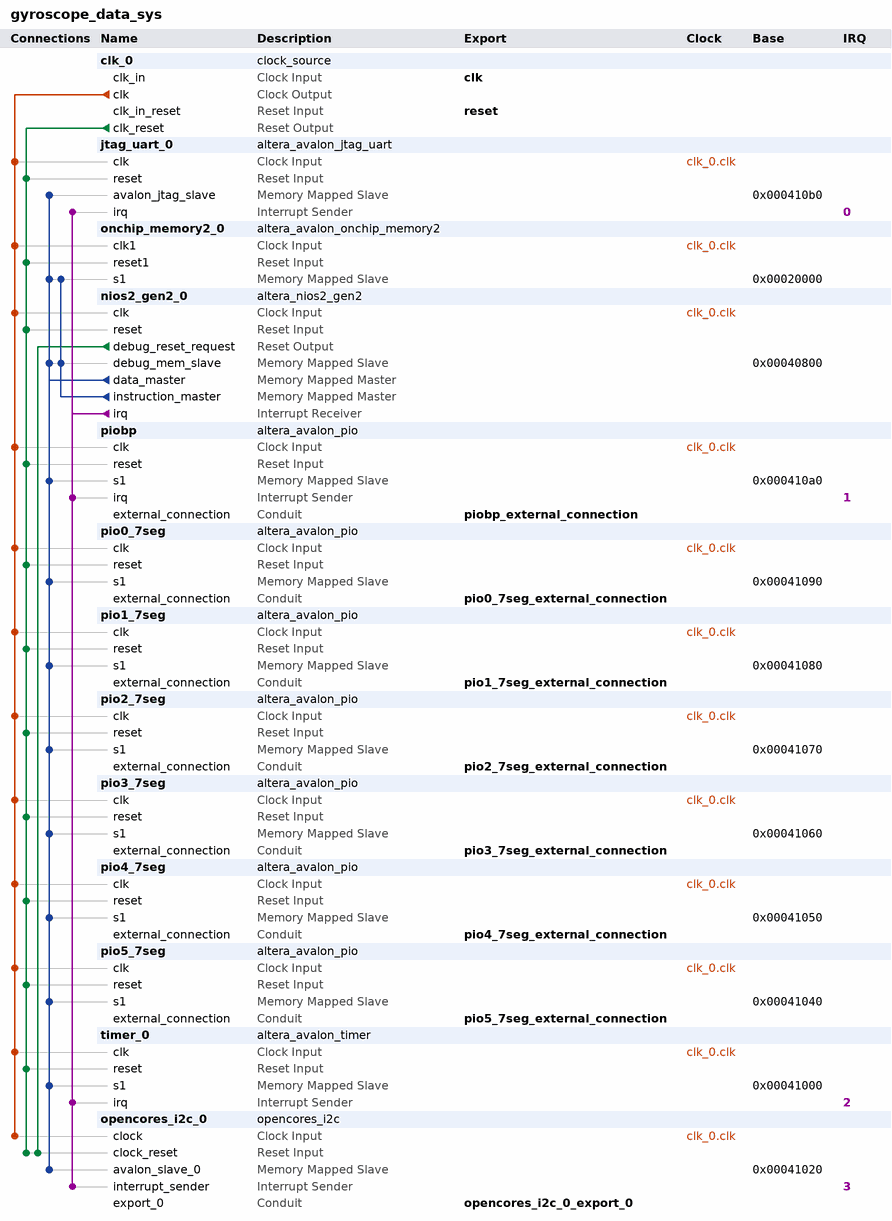
[diagram p0: system contents]
# Platform Designer (Qsys) system gyroscope_data_sys, Cyclone V 5CGXFC7C7F23C8
# Parameters at their usual value, and those the tool derives, are not listed.
package require -exact qsys 18.1
create_system gyroscope_data_sys
set_project_property DEVICE_FAMILY {Cyclone V}
set_project_property DEVICE 5CGXFC7C7F23C8

add_instance clk_0 clock_source 18.1
set_instance_parameter_value clk_0 clockFrequency 50000000

add_instance jtag_uart_0 altera_avalon_jtag_uart 18.1
set_instance_parameter_value jtag_uart_0 simInteractiveOptions NO_INTERACTIVE_WINDOWS

add_instance onchip_memory2_0 altera_avalon_onchip_memory2 18.1
set_instance_parameter_value onchip_memory2_0 dataWidth 32
set_instance_parameter_value onchip_memory2_0 dualPort false
set_instance_parameter_value onchip_memory2_0 initMemContent false
set_instance_parameter_value onchip_memory2_0 initializationFileName C:/intelFPGA/18.1/Podgorski_Lab3/Software/App/mem_init/gyroscope_data_sys_onchip_memory2_0.hex
set_instance_parameter_value onchip_memory2_0 memorySize 80000

add_instance nios2_gen2_0 altera_nios2_gen2 18.1
set_instance_parameter_value nios2_gen2_0 dcache_size 2048
set_instance_parameter_value nios2_gen2_0 exceptionSlave onchip_memory2_0.s1
set_instance_parameter_value nios2_gen2_0 icache_size 4096
set_instance_parameter_value nios2_gen2_0 impl Tiny
set_instance_parameter_value nios2_gen2_0 resetSlave onchip_memory2_0.s1

add_instance piobp altera_avalon_pio 18.1
set_instance_parameter_value piobp captureEdge true
set_instance_parameter_value piobp direction Input
set_instance_parameter_value piobp edgeType FALLING
set_instance_parameter_value piobp generateIRQ true
set_instance_parameter_value piobp irqType EDGE
set_instance_parameter_value piobp width 1

add_instance pio0_7seg altera_avalon_pio 18.1
set_instance_parameter_value pio0_7seg direction Output
set_instance_parameter_value pio0_7seg width 4

add_instance pio1_7seg altera_avalon_pio 18.1
set_instance_parameter_value pio1_7seg direction Output
set_instance_parameter_value pio1_7seg width 4

add_instance pio2_7seg altera_avalon_pio 18.1
set_instance_parameter_value pio2_7seg direction Output
set_instance_parameter_value pio2_7seg width 4

add_instance pio3_7seg altera_avalon_pio 18.1
set_instance_parameter_value pio3_7seg direction Output
set_instance_parameter_value pio3_7seg width 4

add_instance pio4_7seg altera_avalon_pio 18.1
set_instance_parameter_value pio4_7seg direction Output
set_instance_parameter_value pio4_7seg width 4

add_instance pio5_7seg altera_avalon_pio 18.1
set_instance_parameter_value pio5_7seg direction Output
set_instance_parameter_value pio5_7seg width 4

add_instance timer_0 altera_avalon_timer 18.1
set_instance_parameter_value timer_0 period 1
set_instance_parameter_value timer_0 periodUnits SEC

add_instance opencores_i2c_0 opencores_i2c 9.1

# connections
add_connection clk_0.clk jtag_uart_0.clk clock
add_connection clk_0.clk nios2_gen2_0.clk clock
add_connection clk_0.clk onchip_memory2_0.clk1 clock
add_connection clk_0.clk opencores_i2c_0.clock clock
add_connection clk_0.clk pio0_7seg.clk clock
add_connection clk_0.clk pio1_7seg.clk clock
add_connection clk_0.clk pio2_7seg.clk clock
add_connection clk_0.clk pio3_7seg.clk clock
add_connection clk_0.clk pio4_7seg.clk clock
add_connection clk_0.clk pio5_7seg.clk clock
add_connection clk_0.clk piobp.clk clock
add_connection clk_0.clk timer_0.clk clock
add_connection clk_0.clk_reset jtag_uart_0.reset reset
add_connection clk_0.clk_reset nios2_gen2_0.reset reset
add_connection clk_0.clk_reset onchip_memory2_0.reset1 reset
add_connection clk_0.clk_reset opencores_i2c_0.clock_reset reset
add_connection clk_0.clk_reset pio0_7seg.reset reset
add_connection clk_0.clk_reset pio1_7seg.reset reset
add_connection clk_0.clk_reset pio2_7seg.reset reset
add_connection clk_0.clk_reset pio3_7seg.reset reset
add_connection clk_0.clk_reset pio4_7seg.reset reset
add_connection clk_0.clk_reset pio5_7seg.reset reset
add_connection clk_0.clk_reset piobp.reset reset
add_connection clk_0.clk_reset timer_0.reset reset
add_connection nios2_gen2_0.debug_reset_request opencores_i2c_0.clock_reset reset
add_connection nios2_gen2_0.data_master jtag_uart_0.avalon_jtag_slave avalon
set_connection_parameter_value nios2_gen2_0.data_master/jtag_uart_0.avalon_jtag_slave baseAddress 0x000410b0
add_connection nios2_gen2_0.data_master nios2_gen2_0.debug_mem_slave avalon
set_connection_parameter_value nios2_gen2_0.data_master/nios2_gen2_0.debug_mem_slave baseAddress 0x00040800
add_connection nios2_gen2_0.data_master onchip_memory2_0.s1 avalon
set_connection_parameter_value nios2_gen2_0.data_master/onchip_memory2_0.s1 baseAddress 0x00020000
add_connection nios2_gen2_0.data_master opencores_i2c_0.avalon_slave_0 avalon
set_connection_parameter_value nios2_gen2_0.data_master/opencores_i2c_0.avalon_slave_0 baseAddress 0x00041020
add_connection nios2_gen2_0.data_master pio0_7seg.s1 avalon
set_connection_parameter_value nios2_gen2_0.data_master/pio0_7seg.s1 baseAddress 0x00041090
add_connection nios2_gen2_0.data_master pio1_7seg.s1 avalon
set_connection_parameter_value nios2_gen2_0.data_master/pio1_7seg.s1 baseAddress 0x00041080
add_connection nios2_gen2_0.data_master pio2_7seg.s1 avalon
set_connection_parameter_value nios2_gen2_0.data_master/pio2_7seg.s1 baseAddress 0x00041070
add_connection nios2_gen2_0.data_master pio3_7seg.s1 avalon
set_connection_parameter_value nios2_gen2_0.data_master/pio3_7seg.s1 baseAddress 0x00041060
add_connection nios2_gen2_0.data_master pio4_7seg.s1 avalon
set_connection_parameter_value nios2_gen2_0.data_master/pio4_7seg.s1 baseAddress 0x00041050
add_connection nios2_gen2_0.data_master pio5_7seg.s1 avalon
set_connection_parameter_value nios2_gen2_0.data_master/pio5_7seg.s1 baseAddress 0x00041040
add_connection nios2_gen2_0.data_master piobp.s1 avalon
set_connection_parameter_value nios2_gen2_0.data_master/piobp.s1 baseAddress 0x000410a0
add_connection nios2_gen2_0.data_master timer_0.s1 avalon
set_connection_parameter_value nios2_gen2_0.data_master/timer_0.s1 baseAddress 0x00041000
add_connection nios2_gen2_0.instruction_master nios2_gen2_0.debug_mem_slave avalon
set_connection_parameter_value nios2_gen2_0.instruction_master/nios2_gen2_0.debug_mem_slave baseAddress 0x00040800
add_connection nios2_gen2_0.instruction_master onchip_memory2_0.s1 avalon
set_connection_parameter_value nios2_gen2_0.instruction_master/onchip_memory2_0.s1 baseAddress 0x00020000
add_connection nios2_gen2_0.irq jtag_uart_0.irq interrupt
set_connection_parameter_value nios2_gen2_0.irq/jtag_uart_0.irq irqNumber 0
add_connection nios2_gen2_0.irq opencores_i2c_0.interrupt_sender interrupt
set_connection_parameter_value nios2_gen2_0.irq/opencores_i2c_0.interrupt_sender irqNumber 3
add_connection nios2_gen2_0.irq piobp.irq interrupt
set_connection_parameter_value nios2_gen2_0.irq/piobp.irq irqNumber 1
add_connection nios2_gen2_0.irq timer_0.irq interrupt
set_connection_parameter_value nios2_gen2_0.irq/timer_0.irq irqNumber 2

# exported interfaces
add_interface clk clock sink
set_interface_property clk EXPORT_OF clk_0.clk_in
add_interface opencores_i2c_0_export_0 conduit end
set_interface_property opencores_i2c_0_export_0 EXPORT_OF opencores_i2c_0.export_0
add_interface pio0_7seg_external_connection conduit end
set_interface_property pio0_7seg_external_connection EXPORT_OF pio0_7seg.external_connection
add_interface pio1_7seg_external_connection conduit end
set_interface_property pio1_7seg_external_connection EXPORT_OF pio1_7seg.external_connection
add_interface pio2_7seg_external_connection conduit end
set_interface_property pio2_7seg_external_connection EXPORT_OF pio2_7seg.external_connection
add_interface pio3_7seg_external_connection conduit end
set_interface_property pio3_7seg_external_connection EXPORT_OF pio3_7seg.external_connection
add_interface pio4_7seg_external_connection conduit end
set_interface_property pio4_7seg_external_connection EXPORT_OF pio4_7seg.external_connection
add_interface pio5_7seg_external_connection conduit end
set_interface_property pio5_7seg_external_connection EXPORT_OF pio5_7seg.external_connection
add_interface piobp_external_connection conduit end
set_interface_property piobp_external_connection EXPORT_OF piobp.external_connection
add_interface reset reset sink
set_interface_property reset EXPORT_OF clk_0.clk_in_reset

set_interconnect_requirement {$system} qsys_mm.clockCrossingAdapter HANDSHAKE
set_interconnect_requirement {$system} qsys_mm.enableEccProtection FALSE
set_interconnect_requirement {$system} qsys_mm.insertDefaultSlave FALSE
set_interconnect_requirement {$system} qsys_mm.maxAdditionalLatency 1

save_system gyroscope_data_sys.qsys
